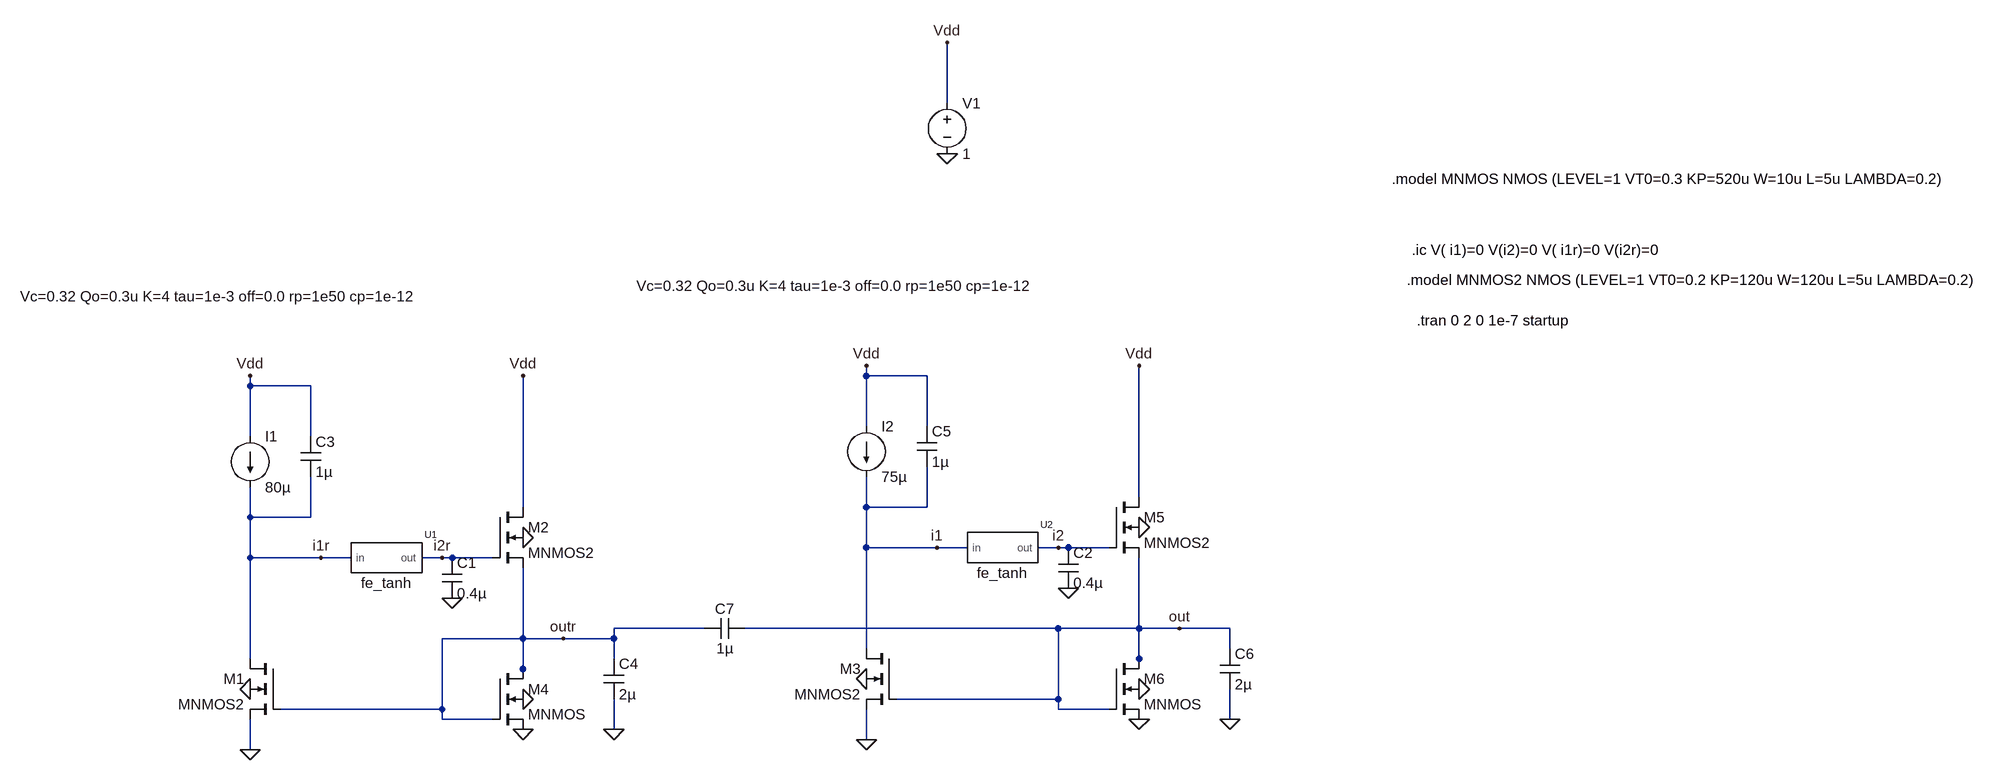
[diagram p0: schematic Neuron_oscillator_coupled.asc]
Neuron_oscillator_coupled.asc, the LTspice schematic file:
Version 4
SHEET 1 1192 724
WIRE -496 -320 -496 -416
WIRE -624 112 -624 96
WIRE -528 112 -624 112
WIRE -1600 128 -1600 112
WIRE -1504 128 -1600 128
WIRE -624 192 -624 112
WIRE -528 192 -528 112
WIRE -1600 208 -1600 128
WIRE -1504 208 -1504 128
WIRE -192 304 -192 96
WIRE -1168 320 -1168 112
WIRE -624 320 -624 272
WIRE -528 320 -528 256
WIRE -528 320 -624 320
WIRE -1600 336 -1600 288
WIRE -1504 336 -1504 272
WIRE -1504 336 -1600 336
WIRE -624 384 -624 320
WIRE -512 384 -624 384
WIRE -464 384 -512 384
WIRE -320 384 -352 384
WIRE -304 384 -320 384
WIRE -240 384 -304 384
WIRE -1600 400 -1600 336
WIRE -1488 400 -1600 400
WIRE -1440 400 -1488 400
WIRE -1296 400 -1328 400
WIRE -1280 400 -1296 400
WIRE -1216 400 -1280 400
WIRE -880 512 -1024 512
WIRE -320 512 -816 512
WIRE -192 512 -192 400
WIRE -192 512 -320 512
WIRE -128 512 -192 512
WIRE -48 512 -128 512
WIRE -1168 528 -1168 416
WIRE -1168 528 -1296 528
WIRE -1104 528 -1168 528
WIRE -1024 528 -1024 512
WIRE -1024 528 -1104 528
WIRE -624 544 -624 384
WIRE -48 544 -48 512
WIRE -1600 560 -1600 400
WIRE -1024 560 -1024 528
WIRE -192 560 -192 512
WIRE -1168 576 -1168 528
WIRE -192 576 -192 560
WIRE -1168 592 -1168 576
WIRE -320 624 -320 512
WIRE -320 624 -576 624
WIRE -1296 640 -1296 528
WIRE -1296 640 -1552 640
WIRE -320 640 -320 624
WIRE -240 640 -320 640
WIRE -1296 656 -1296 640
WIRE -1216 656 -1296 656
WIRE -48 656 -48 608
WIRE -1024 672 -1024 624
WIRE -624 688 -624 640
WIRE -1600 704 -1600 656
FLAG -496 -240 0
FLAG -496 -416 Vdd
FLAG -1600 704 0
FLAG -1600 608 0
FLAG -1600 112 Vdd
FLAG -1168 112 Vdd
FLAG -1168 368 0
FLAG -1280 464 0
FLAG -1488 400 i1r
FLAG -1024 672 0
FLAG -1168 672 0
FLAG -1168 624 0
FLAG -1104 528 outr
FLAG -1296 400 i2r
FLAG -624 688 0
FLAG -624 592 0
FLAG -624 96 Vdd
FLAG -192 96 Vdd
FLAG -192 352 0
FLAG -304 448 0
FLAG -512 384 i1
FLAG -48 656 0
FLAG -192 656 0
FLAG -192 608 0
FLAG -128 512 out
FLAG -320 384 i2
SYMBOL voltage -496 -336 R0
WINDOW 123 0 0 Left 0
WINDOW 39 0 0 Left 0
SYMATTR InstName V1
SYMATTR Value 1
SYMBOL nmos4 -1552 560 M0
SYMATTR InstName M1
SYMATTR Value MNMOS2
SYMBOL nmos4 -1216 320 R0
SYMATTR InstName M2
SYMATTR Value MNMOS2
SYMBOL cap -1296 400 R0
SYMATTR InstName C1
SYMATTR Value 0.4µ
SYMBOL current -1600 208 R0
WINDOW 123 0 0 Left 0
WINDOW 39 0 0 Left 0
SYMATTR InstName I1
SYMATTR Value 80µ
SYMBOL cap -1520 208 R0
SYMATTR InstName C3
SYMATTR Value 1µ
SYMBOL cap -1040 560 R0
SYMATTR InstName C4
SYMATTR Value 2µ
SYMBOL nmos4 -1216 576 R0
SYMATTR InstName M4
SYMATTR Value MNMOS
SYMBOL fe_tanh -1392 400 R0
WINDOW 39 -257 -430 Top 2
SYMATTR SpiceLine Vc=0.32 Qo=0.3u K=4 tau=1e-3 off=0.0 rp=1e50 cp=1e-12
SYMATTR InstName U1
SYMBOL nmos4 -576 544 M0
SYMATTR InstName M3
SYMATTR Value MNMOS2
SYMBOL nmos4 -240 304 R0
SYMATTR InstName M5
SYMATTR Value MNMOS2
SYMBOL cap -320 384 R0
SYMATTR InstName C2
SYMATTR Value 0.4µ
SYMBOL current -624 192 R0
WINDOW 123 0 0 Left 0
WINDOW 39 0 0 Left 0
SYMATTR InstName I2
SYMATTR Value 75µ
SYMBOL cap -544 192 R0
SYMATTR InstName C5
SYMATTR Value 1µ
SYMBOL cap -64 544 R0
SYMATTR InstName C6
SYMATTR Value 2µ
SYMBOL nmos4 -240 560 R0
SYMATTR InstName M6
SYMATTR Value MNMOS
SYMBOL fe_tanh -416 384 R0
WINDOW 39 -257 -430 Top 2
SYMATTR SpiceLine Vc=0.32 Qo=0.3u K=4 tau=1e-3 off=0.0 rp=1e50 cp=1e-12
SYMATTR InstName U2
SYMBOL cap -816 496 R90
WINDOW 0 0 32 VBottom 2
WINDOW 3 32 32 VTop 2
SYMATTR InstName C7
SYMATTR Value 1µ
TEXT 208 -200 Left 2 !.model MNMOS NMOS (LEVEL=1 VT0=0.3 KP=520u W=10u L=5u LAMBDA=0.2)
TEXT 248 24 Left 2 !.tran 0 2 0 1e-7 startup
TEXT 240 -88 Left 2 !.ic V( i1)=0 V(i2)=0 V( i1r)=0 V(i2r)=0
TEXT 232 -40 Left 2 !.model MNMOS2 NMOS (LEVEL=1 VT0=0.2 KP=120u W=120u L=5u LAMBDA=0.2)

The netlist it stands for:
* Neuron_oscillator_coupled.asc
V1 Vdd 0 1
M1 i1r outr 0 0 MNMOS2
M2 Vdd i2r outr 0 MNMOS2
C1 i2r 0 0.4µ
I1 Vdd i1r 80µ
C3 Vdd i1r 1µ
C4 outr 0 2µ
M4 outr outr 0 0 MNMOS
XU1 i1r i2r fe_tanh Vc=0.32 Qo=0.3u K=4 tau=1e-3 off=0.0 rp=1e50 cp=1e-12  ; pins in out
M3 i1 out 0 0 MNMOS2
M5 Vdd i2 out 0 MNMOS2
C2 i2 0 0.4µ
I2 Vdd i1 75µ
C5 Vdd i1 1µ
C6 out 0 2µ
M6 out out 0 0 MNMOS
XU2 i1 i2 fe_tanh Vc=0.32 Qo=0.3u K=4 tau=1e-3 off=0.0 rp=1e50 cp=1e-12  ; pins in out
C7 out outr 1µ
.model NMOS NMOS
.model PMOS PMOS
.lib standard.mos
.model MNMOS NMOS (LEVEL=1 VT0=0.3 KP=520u W=10u L=5u LAMBDA=0.2)
.tran 0 2 0 1e-7 startup
.ic V( i1)=0 V(i2)=0 V( i1r)=0 V(i2r)=0
.model MNMOS2 NMOS (LEVEL=1 VT0=0.2 KP=120u W=120u L=5u LAMBDA=0.2)
.lib C:\Users\MBX\Desktop\Investigacion\Spice-LK-Model\Fe_model\fe_tanh_ni.sp
.backanno
.end